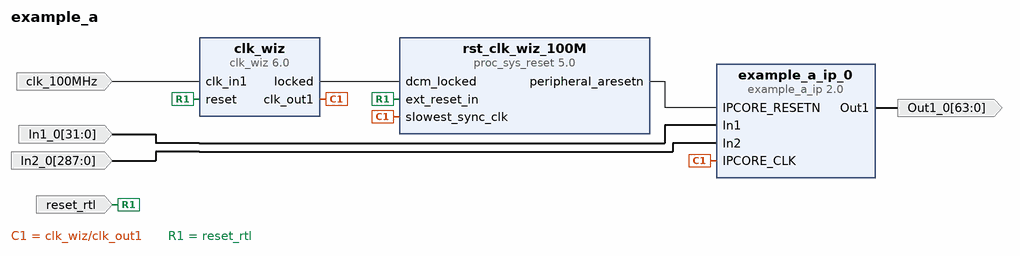
[diagram p0: block diagram of the top level]
# Vivado block design example_a, xc7z010clg400-1, Vivado 2023.2
create_bd_design example_a

create_bd_port -dir I -type clk clk_100MHz
set_property -dict {CONFIG.FREQ_HZ 100000000} [get_bd_ports clk_100MHz]
create_bd_port -dir I -type rst reset_rtl
set_property -dict {CONFIG.POLARITY ACTIVE_HIGH} [get_bd_ports reset_rtl]
create_bd_port -dir I -from 31 -to 0 In1_0
create_bd_port -dir I -from 287 -to 0 In2_0
create_bd_port -dir O -from 63 -to 0 Out1_0

create_bd_cell -type ip -vlnv user.org:ip:example_a_ip:2.0 example_a_ip_0
create_bd_cell -type ip -vlnv xilinx.com:ip:clk_wiz:6.0 clk_wiz
create_bd_cell -type ip -vlnv xilinx.com:ip:proc_sys_reset:5.0 rst_clk_wiz_100M

# ---- connections ----

connect_bd_net -net In1_0_1 [get_bd_ports In1_0] [get_bd_pins example_a_ip_0/In1]
connect_bd_net -net In2_0_1 [get_bd_ports In2_0] [get_bd_pins example_a_ip_0/In2]
connect_bd_net [get_bd_ports clk_100MHz] [get_bd_pins clk_wiz/clk_in1]
connect_bd_net [get_bd_pins clk_wiz/clk_out1] [get_bd_pins example_a_ip_0/IPCORE_CLK] [get_bd_pins rst_clk_wiz_100M/slowest_sync_clk]
connect_bd_net [get_bd_pins clk_wiz/locked] [get_bd_pins rst_clk_wiz_100M/dcm_locked]
connect_bd_net [get_bd_pins example_a_ip_0/Out1] [get_bd_ports Out1_0]
connect_bd_net [get_bd_ports reset_rtl] [get_bd_pins clk_wiz/reset] [get_bd_pins rst_clk_wiz_100M/ext_reset_in]
connect_bd_net [get_bd_pins rst_clk_wiz_100M/peripheral_aresetn] [get_bd_pins example_a_ip_0/IPCORE_RESETN]

validate_bd_design
save_bd_design
